# EAGLE schematic tacho (EAGLE 6.3)
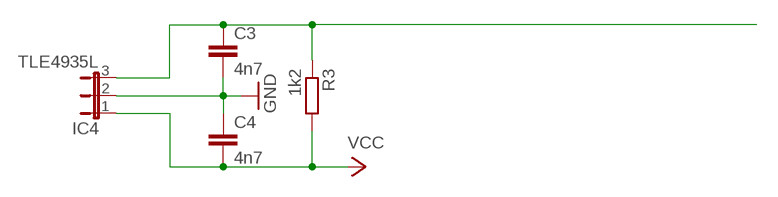
[diagram p0: schematic, sheet 1]

## Parts
C3  4n7  C-EU025-025X050  [C025-025X050]
C4  4n7  C-EU025-025X050  [C025-025X050]
IC4  TLE4935L  JP2E  [JP2]
R3  1k2  R-EU_0207/10  [0207/10]

## Nets
GND: C3.2 C4.1 IC4.2
V_Q: C3.1 IC4.3 R3.1
VCC: C4.2 IC4.1 R3.2

## Library data of the parts
C3 C4 = rcl:C-EU: CAPACITOR, European symbol
IC4 = jumper:JP2E: JUMPER
R3 = rcl:R-EU_: RESISTOR, European symbol